# EAGLE schematic BAHIA (EAGLE 9.6.2)
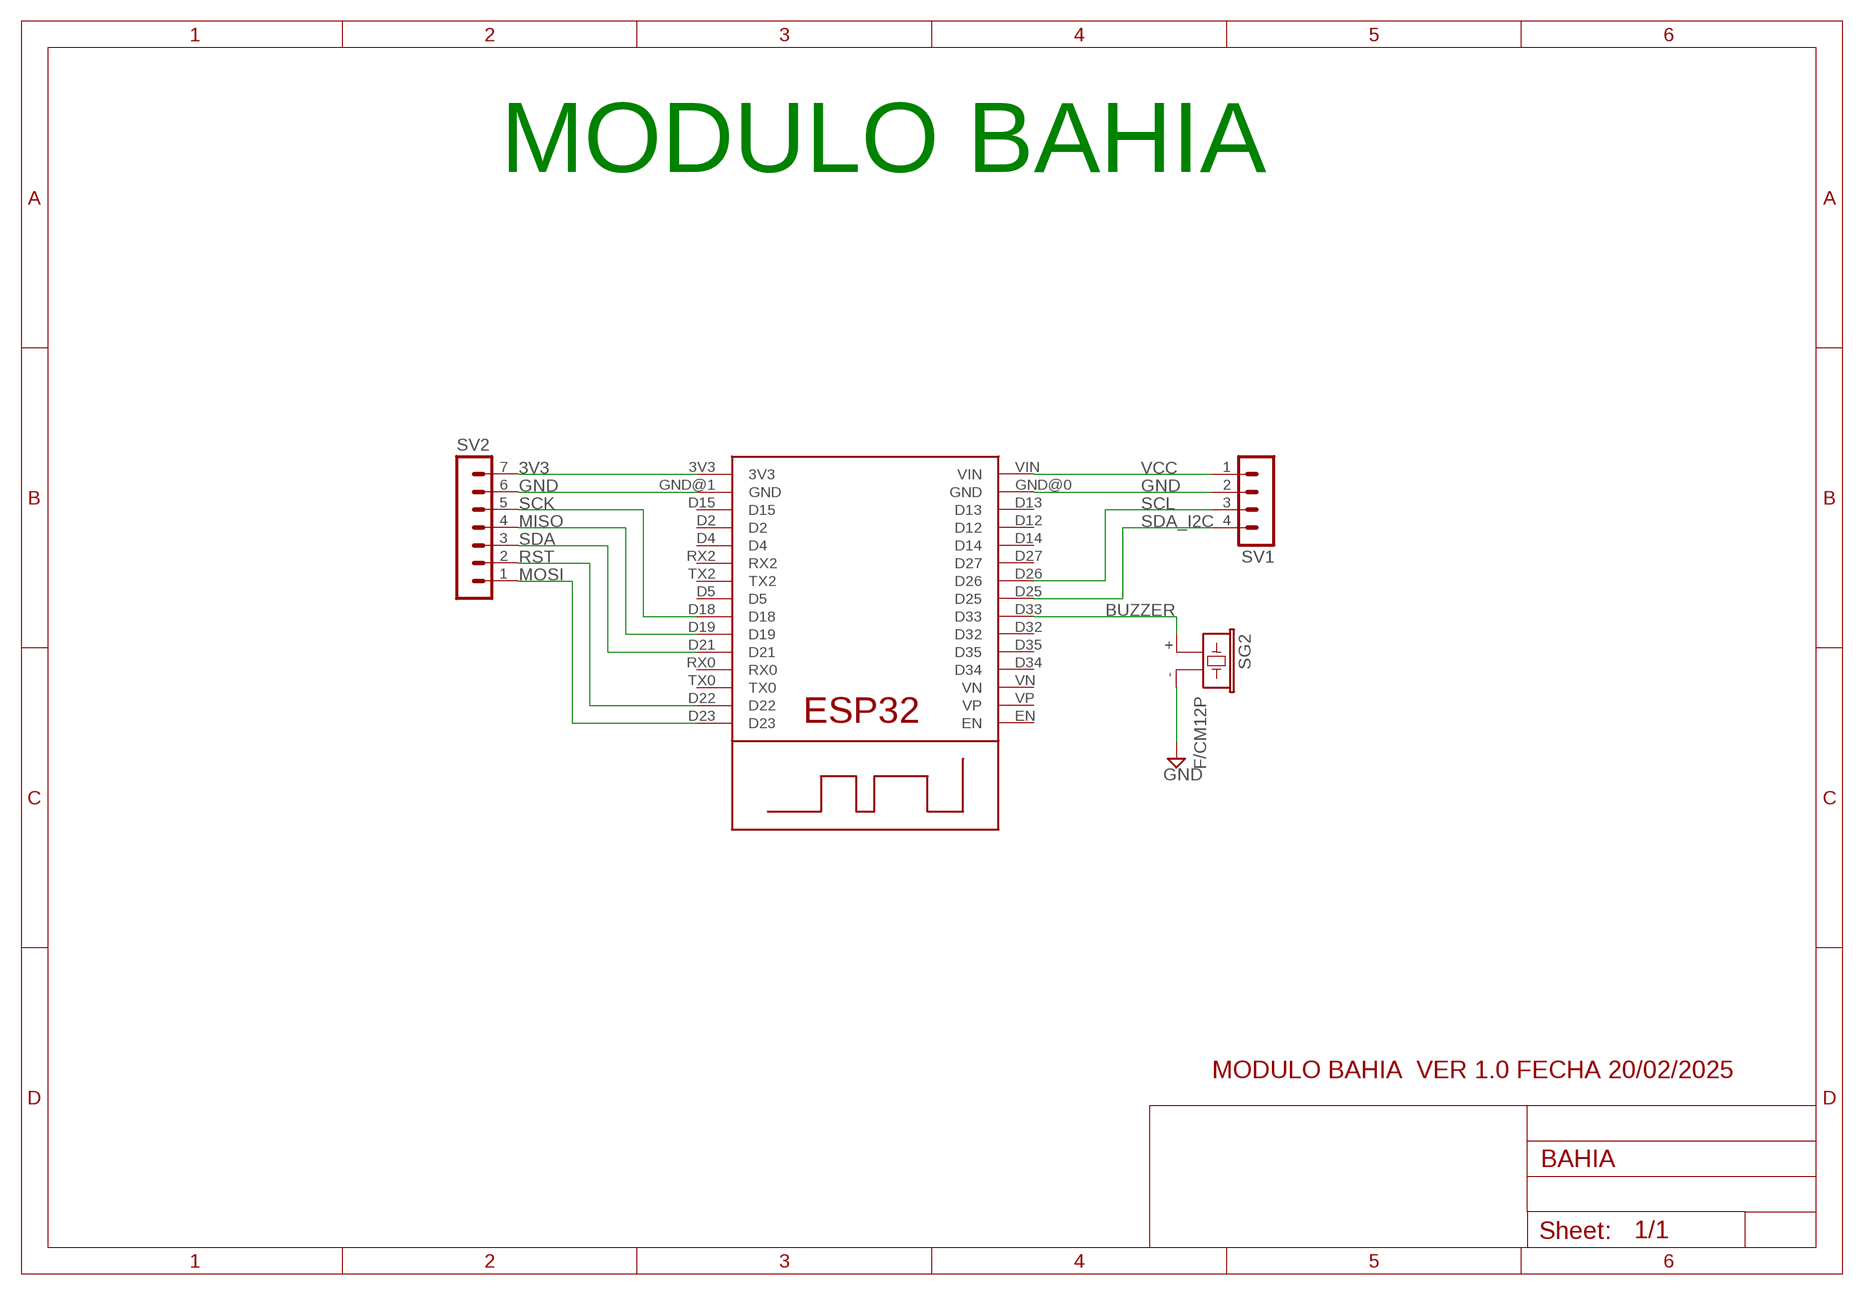
[diagram p0: schematic, sheet 1]

## Parts
SG2  F/CM12P  [F/CM12P]
SV1  MA04-1  [MA04-1]
SV2  MA07-1  [MA07-1]
U$1  ESP32WROOM  [ESP32WROOM]

## Nets
3V3: SV2.7 U$1.3V3
BUZZER: SG2.+ U$1.D33
GND: SG2.- SV1.2 SV2.6 U$1.GND@0(GND) U$1.GND@1(GND)
MISO: SV2.4 U$1.D19
MOSI: SV2.1 U$1.D23
RST: SV2.2 U$1.D22
SCK: SV2.5 U$1.D18
SCL: SV1.3 U$1.D26
SDA: SV2.3 U$1.D21
SDA_I2C: SV1.4 U$1.D25
VCC: SV1.1 U$1.VIN
Unconnected: U$1.D2 U$1.D4 U$1.D5 U$1.D12 U$1.D13 U$1.D14 U$1.D15 U$1.D27 U$1.D32 U$1.D34 U$1.D35 U$1.EN U$1.RX0 U$1.RX2 U$1.TX0 U$1.TX2 U$1.VN U$1.VP

## Notes on the sheet
- MODULO BAHIA
- MODULO BAHIA  VER 1.0 FECHA 20/02/2025

## Library data of the parts
SG2 = buzzer:F/CM12P: BUZZER Source: Buerklin; OC_FARNELL: unknown; OC_NEWARK: unknown
SV1 = con-lstb:MA04-1: PIN HEADER; OC_FARNELL: unknown; OC_NEWARK: unknown
SV2 = con-lstb:MA07-1: PIN HEADER; OC_FARNELL: unknown; OC_NEWARK: unknown
U$1 = MODULAR:ESP32WROOM